# EAGLE design WatchDog (EAGLE 9.5.2)
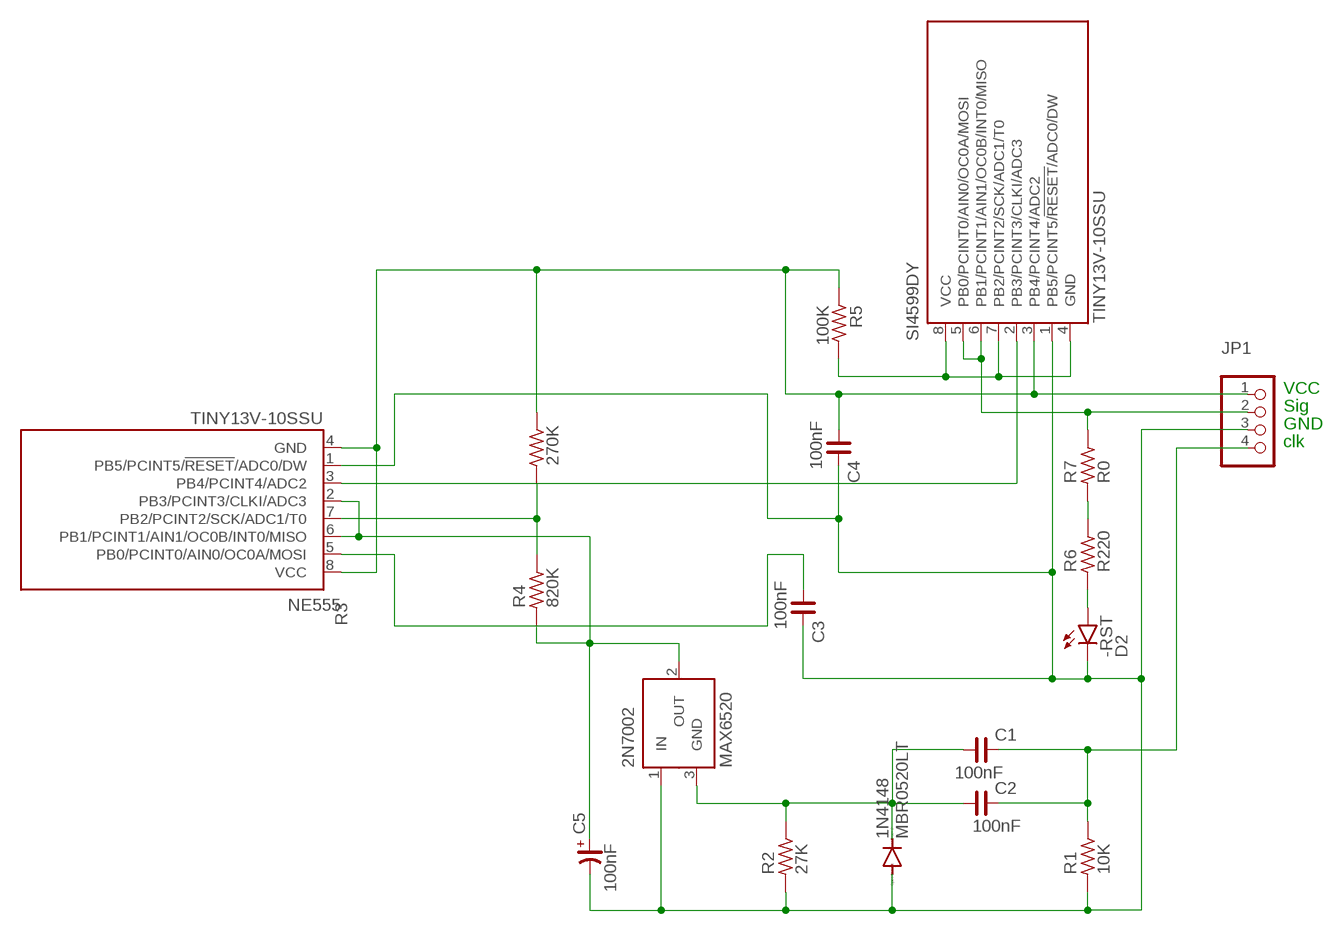
[diagram p0: schematic, sheet 1]

## Parts
1N4148  MBR0520LT  [SOD123]
2N7002  MAX6520  [SOT23]
-RST  D2  LEDSML0603  [SML0603]
C1  100nF  C_0603  [C0603]
C2  100nF  C_0603  [C0603]
C3  100nF  C_0603  [C0603]
C4  100nF  C_0603  [C0603]
C5  100nF  CP_SV-E/F  [CSV-E/F]
JP1  PINHD-1X4  [1X04]
NE555  TINY13V-10SSU  [8S1]
R1  10K  R_0603  [R0603]
R2  27K  R_0603  [R0603]
R3  270K  R_0603  [R0603]
R4  820K  R_0603  [R0603]
R5  100K  R_0603  [R0603]
R6  R220  R_0603  [R0603]
R7  R0  R_0402  [R0402]
SI4599DY  TINY13V-10SSU  [8S1]

## Nets
N$1: 1N4148.C 2N7002.3(GND) C1.1 C2.1 R2.2
N$2: R6.2 R7.1
N$3: NE555.7(PB2/PCINT2/SCK/ADC1/T0) R3.1 R4.2
N$4: -RST.A R6.1
N$6: JP1.2 R7.2 SI4599DY.5(PB0/PCINT0/AIN0/OC0A/MOSI) SI4599DY.6(PB1/PCINT1/AIN1/OC0B/INT0/MISO)
N$7: R5.2 SI4599DY.4(GND) SI4599DY.7(PB2/PCINT2/SCK/ADC1/T0) SI4599DY.8(VCC)
N$8: 2N7002.2(OUT) C5.+ NE555.2(PB3/PCINT3/CLKI/ADC3) NE555.6(PB1/PCINT1/AIN1/OC0B/INT0/MISO) R4.1
N$9: C4.1 JP1.1 NE555.4(GND) NE555.8(VCC) R3.2 R5.1 SI4599DY.3(PB4/PCINT4/ADC2)
N$10: NE555.3(PB4/PCINT4/ADC2) SI4599DY.2(PB3/PCINT3/CLKI/ADC3)
N$11: C3.1 NE555.5(PB0/PCINT0/AIN0/OC0A/MOSI)
N$12: C1.2 C2.2 JP1.4 R1.2
N$14: 1N4148.A 2N7002.1(IN) -RST.C C3.2 C4.2 C5.- JP1.3 NE555.1(PB5/PCINT5/!RESET!/ADC0/DW) R1.1 R2.1 SI4599DY.1(PB5/PCINT5/!RESET!/ADC0/DW)

## Notes on the sheet
- VCC
- Sig
- GND
- clk

## Library data of the parts
1N4148 = diode:MBR0520LT: SCHOTTKY BARRIER RECTIFIER Source: http://onsemi.com .. MBR0520LT1-D.pdf
2N7002 = maxim:MAX6520: 1.2V Voltage Reference 50ppm/°C, SOT23, 3-Terminal Source: Data sheet <http://datasheets.maxim-ic.com/en/ds/MAX6520.pdf>; MF: MAXIM; MPN: MAX6520EUR-T; OC_FARNELL: unknown; OC_NEWARK: 02J4586
-RST = led:LED: LED OSRAM: - CHIPLED LG R971, LG N971, LY N971, LG Q971, LY Q971, LO R971, LY R971 LH N974, LH R974 LS Q976, LO Q976, LY Q976 LO Q996 - Hyper CHIPLED LW Q18S LB Q993, LB Q99A, LB R99A - SideLED LS A670, LO A670, LY A670, LG A670, LP A670 LB A673, LV A673, LT A673, LW A673 LH A674 LY A675 LS A676, LA A676, LO A676, LY A676, LW A676 LS A679, LY A679, LG A679 - Hyper Micro SIDELED® LS Y876, LA Y876, LO Y876, LY Y876 LT Y87S - SmartLED LW L88C, LW L88S LB L89C, LB L89S, LG L890 LS L89K, LO L89K, LY L89K LS L896, LA L896, LO L896, LY L896 - TOPLED LS T670, LO T670, LY T670, LG T670, LP T670 LSG T670, LSP T670, LSY T670, LOP T670, LYG T670 LG T671, LOG T671, LSG T671 LB T673, LV T673, LT T673, LW T673 LH T674 LS T676, LA T676, LO T676, LY T676, LB T676, LH T676, LSB T676, LW T676 LB T67C, LV T67C, LT T67C, LS T67K, LO T67K, LY T67K, LW E67C LS E67B, LA E67B, LO E67B, LY E67B, LB E67C, LV E67C, LT E67C LW T67C LS T679, LY T679, LG T679 LS T770, LO T770, LY T770, LG T770, LP T770 LB T773, LV T773, LT T773, LW T773 LH T774 LS E675, LA E675, LY E675, LS T675 LS T776, LA T776, LO T776, LY T776, LB T776 LHGB T686 LT T68C, LB T68C - Hyper Mini TOPLED® LB M676 - Mini TOPLED Santana® LG M470 LS M47K, LO M47K, LY M47K Source: http://www.osram.convergy.de LUXEON: - LUMILED® LXK2-PW12-R00, LXK2-PW12-S00, LXK2-PW14-U00, LXK2-PW14-V00 LXK2-PM12-R00, LXK2-PM12-S00, LXK2-PM14-U00 LXK2-PE12-Q00, LXK2-PE12-R00, LXK2-PE12-S00, LXK2-PE14-T00, LXK2-PE14-U00 LXK2-PB12-K00, LXK2-PB12-L00, LXK2-PB12-M00, LXK2-PB14-N00, LXK2-PB14-P00, LXK2-PB14-Q00 LXK2-PR12-L00, LXK2-PR12-M00, LXK2-PR14-Q00, LXK2-PR14-R00 LXK2-PD12-Q00, LXK2-PD12-R00, LXK2-PD12-S00 LXK2-PH12-R00, LXK2-PH12-S00 LXK2-PL12-P00, LXK2-PL12-Q00, LXK2-PL12-R00 Source: www.luxeon.com KINGBRIGHT: KA-3528ASYC Source: www.kingbright.com
C1-C4 = rc-master-smd:C_: NON-POLARIZED CAP
C5 = rc-master-smd:CP_: POLARIZED CAP
JP1 = pinhead:PINHD-1X4: PIN HEADER
NE555 SI4599DY = atmel:TINY13: 8-bit AVR Microcontroller with 1K Bytes In-System Programmable Flash Source: http://www.atmel.com/dyn/resources/prod_documents/2535S.pdf; MPN: ATTINY13V-10SSU; OC_FARNELL: 1455135; OC_NEWARK: 58M3773
R1-R7 = rc-master-smd:R_: RESISTOR

## Board
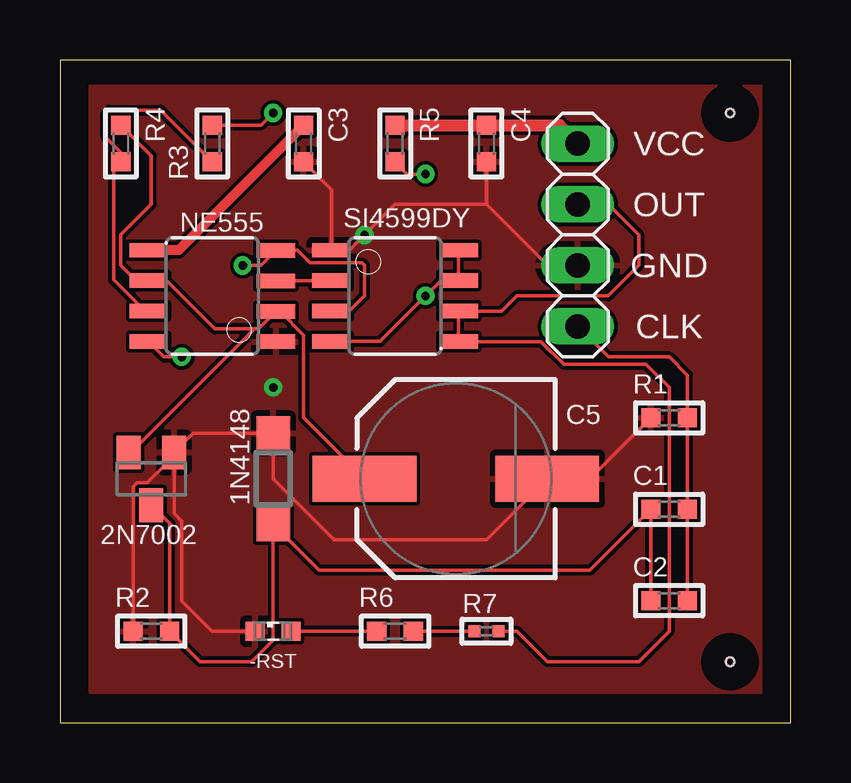
[diagram p1: board, top side]
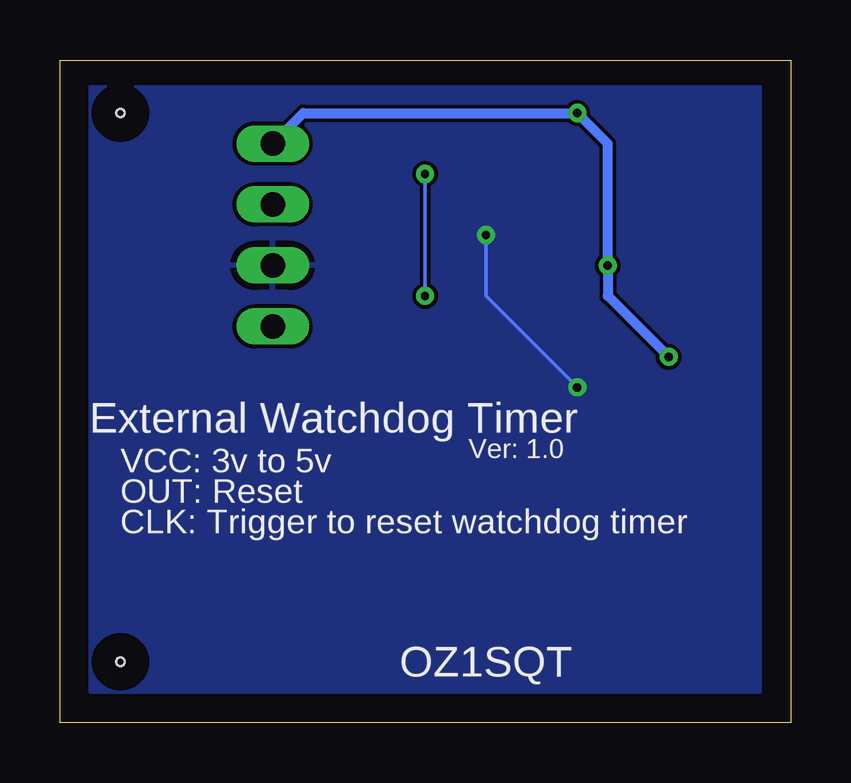
[diagram p2: board, bottom side, seen from below]

Size 30.46 x 27.61 mm. Coordinates in mm from the lower left corner, seen from the top.
Outline: 0,0 30.46,0 30.46,27.61 0,27.61 0,0
Copper layers (1*16): Top 0.035mm / dielectric 1.5mm / Bottom 0.035mm
Design rules "default": minimum track width 6mil, minimum drill 0.35mm, track to track 6mil, track to pad 6mil, pad to pad 6mil, via to via 6mil, smd to smd 6mil, copper to edge 40mil, drill to drill 6mil, minimum pad ring 10mil, minimum via ring 8mil, stop-mask expansion 4mil, vias tented up to drill 0mil, thermal gap 10mil
Holes 0.35 mm at 27.94,2.54 27.94,25.4

### Footprints (pad centres in the part's own frame; a part is rotated, then mirrored left to right if it is on the bottom)
SOD123 = smd 1.4 x 1.4: A 1.9,0; C -1.9,0
SOT23 = smd 1 x 1.4: 1 -0.95,-1.1; 2 0.95,-1.1; 3 0,1.1
SML0603 = smd 0.8 x 0.8: A 0.75,0; C -0.75,0
C0603 = smd 0.8 x 0.8: 1 -0.762,0; 2 0.762,0
CSV-E/F = smd 4.318 x 1.93: + -3.81,0; - 3.81,0
1X04 = drill 1.016 long: 1 -3.81,0; 2 -1.27,0; 3 1.27,0; 4 3.81,0
8S1 = smd 0.6 x 1.6: 1 -1.905,-2.654; 2 -0.645,-2.654; 3 0.625,-2.654; 4 1.895,-2.654; 5 1.905,2.654; 6 0.635,2.654; 7 -0.635,2.654; 8 -1.905,2.654
R0603 = smd 0.8 x 0.8: 1 -0.762,0; 2 0.762,0
R0402 = smd 0.5 x 0.5: 1 -0.508,0; 2 0.508,0

### Placement (x,y rotation side)
1N4148  8.89,10.16 90 top
2N7002  3.81,10.16 180 top
-RST  8.89,3.81 0 top
C1  25.4,8.89 0 top
C2  25.4,5.08 0 top
C3  10.16,24.13 270 top
C4  17.78,24.13 270 top
C5  16.51,10.16 0 top
JP1  21.59,20.32 270 top
NE555  6.35,17.78 90 top
R1  25.4,12.7 0 top
R2  3.81,3.81 0 top
R3  6.35,24.13 90 top
R4  2.54,24.13 270 top
R5  13.97,24.13 270 top
R6  13.97,3.81 0 top
R7  17.78,3.81 0 top
SI4599DY  13.97,17.78 270 top

### Tracks (layer width: path | path; a pad name or v marks a point on that pad's centre or on a via)
N$1
  Top 0.152: 4.61,8.26 2N7002.3 4.57,8.3 R2.2 5.84,2.54 7.99,2.54 8.89,3.44 1N4148.C 10.8,6.35 22.1,6.35 C1.1 C2.1
N$2
  Top 0.152: R6.2 R7.1
N$3
  Top 0.152: 3.17,17.14 NE555.7 3.54,17.14 2.23,18.45 2.23,22.99 2.54,23.29 R4.2 2.54,23.77 1.91,24.4 1.91,25.39 2.04,25.52 4.2,25.52 R3.1
N$4
  Top 0.152: R6.1 -RST.A
N$6
  Top 0.152: SI4599DY.6 SI4599DY.5 20.06,15.88 21,14.94 24.43,14.94 25.4,13.97 25.4,3.81 24.13,2.54 20.32,2.54 19.05,3.81 R7.2 | SI4599DY.6 17.14,17.14 | SI4599DY.6 18.41,17.14 19.05,17.78 22.86,17.78 24.13,19.05 24.13,20.32 22.86,21.59 JP1.2
N$7  (via drill 0.35)
  Top 0.152: SI4599DY.4 13.34,15.88 v15.24,17.78 15.88,18.41 SI4599DY.7 SI4599DY.8 | R5.2 14.48,22.86 v15.24,22.86
  Bottom 0.152: v15.24,22.86 v15.24,17.78
N$8
  Top 0.152: 8.11,16.4 8.27,16.4 NE555.2 9.17,17.13 10.16,16.14 10.16,12.7 C5.+ | 2N7002.2 2.97,11.26 8.11,16.4 | 8.11,16.4 6.46,16.4 4.44,18.41 NE555.6 3.17,18.41 2.54,19.05 2.54,20.32 3.81,21.59 3.81,23.62 R4.1
N$9  (via drill 0.35)
  Top 0.152: 10.78,17.16 SI4599DY.3 12.07,17.16 12.7,17.78 12.7,19.05 12.59,19.16 10.42,19.16 9.9,19.67 NE555.4 | 9.53,19.67 NE555.4 | NE555.4 8.38,19.05 v7.62,19.05 | NE555.8 4.33,15.24 v5.08,15.24 | v8.89,25.4 8.38,24.89 R3.2
  Top 0.508: R5.1 C4.1 20.83,24.89 JP1.1
  Bottom 0.406: v5.08,15.24 7.62,17.78 v7.62,19.05 7.62,24.13 v8.89,25.4 20.32,25.4 JP1.1
N$10
  Top 0.152: NE555.3 11.3,18.41 SI4599DY.2
N$11
  Top 0.406: C3.1 4.95,19.69 NE555.5
N$12
  Top 0.152: JP1.4 22.86,15.24 25.4,15.24 26.16,14.48 R1.2 C1.2 C2.2
N$14  (via drill 0.35)
  Top 0.152: 2N7002.1 5.56,12.06 1N4148.A 8.89,10.16 11.43,7.62 17.78,7.62 C5.- 22.1,10.16 R1.1 | 2N7002.1 4.37,10.87 | C3.2 11.32,22.21 SI4599DY.1 11.32,19.58 11.43,19.46 11.84,19.46 v12.7,20.32 13.97,21.59 17.78,21.59 | 2N7002.1 4.83,11.19 3.64,9.99 3.21,9.99 3.05,9.82 R2.1 | -RST.C 6.35,3.81 5.08,5.08 5.08,8.4 4.76,8.72 2N7002.1 | 17.78,21.59 C4.2 | 17.78,21.59 20.32,19.05 JP1.3 | 8.89,15.76 NE555.1
  Bottom 0.152: v12.7,20.32 12.7,17.78 v8.89,13.97
  pour Bottom: 1.27,26.67 1.27,1.27 29.21,1.27 29.21,26.67
  pour Top: 29.21,1.27 29.21,26.67 1.27,26.67 1.27,1.27

### Text on the board
tPlace: VCC | OUT | GND | CLK
bPlace: External Watchdog Timer | Ver: 1.0 | VCC: 3v to 5v | OUT: Reset | CLK: Trigger to reset watchdog timer | OZ1SQT